# Altium project AM625SIP.PrjPcb
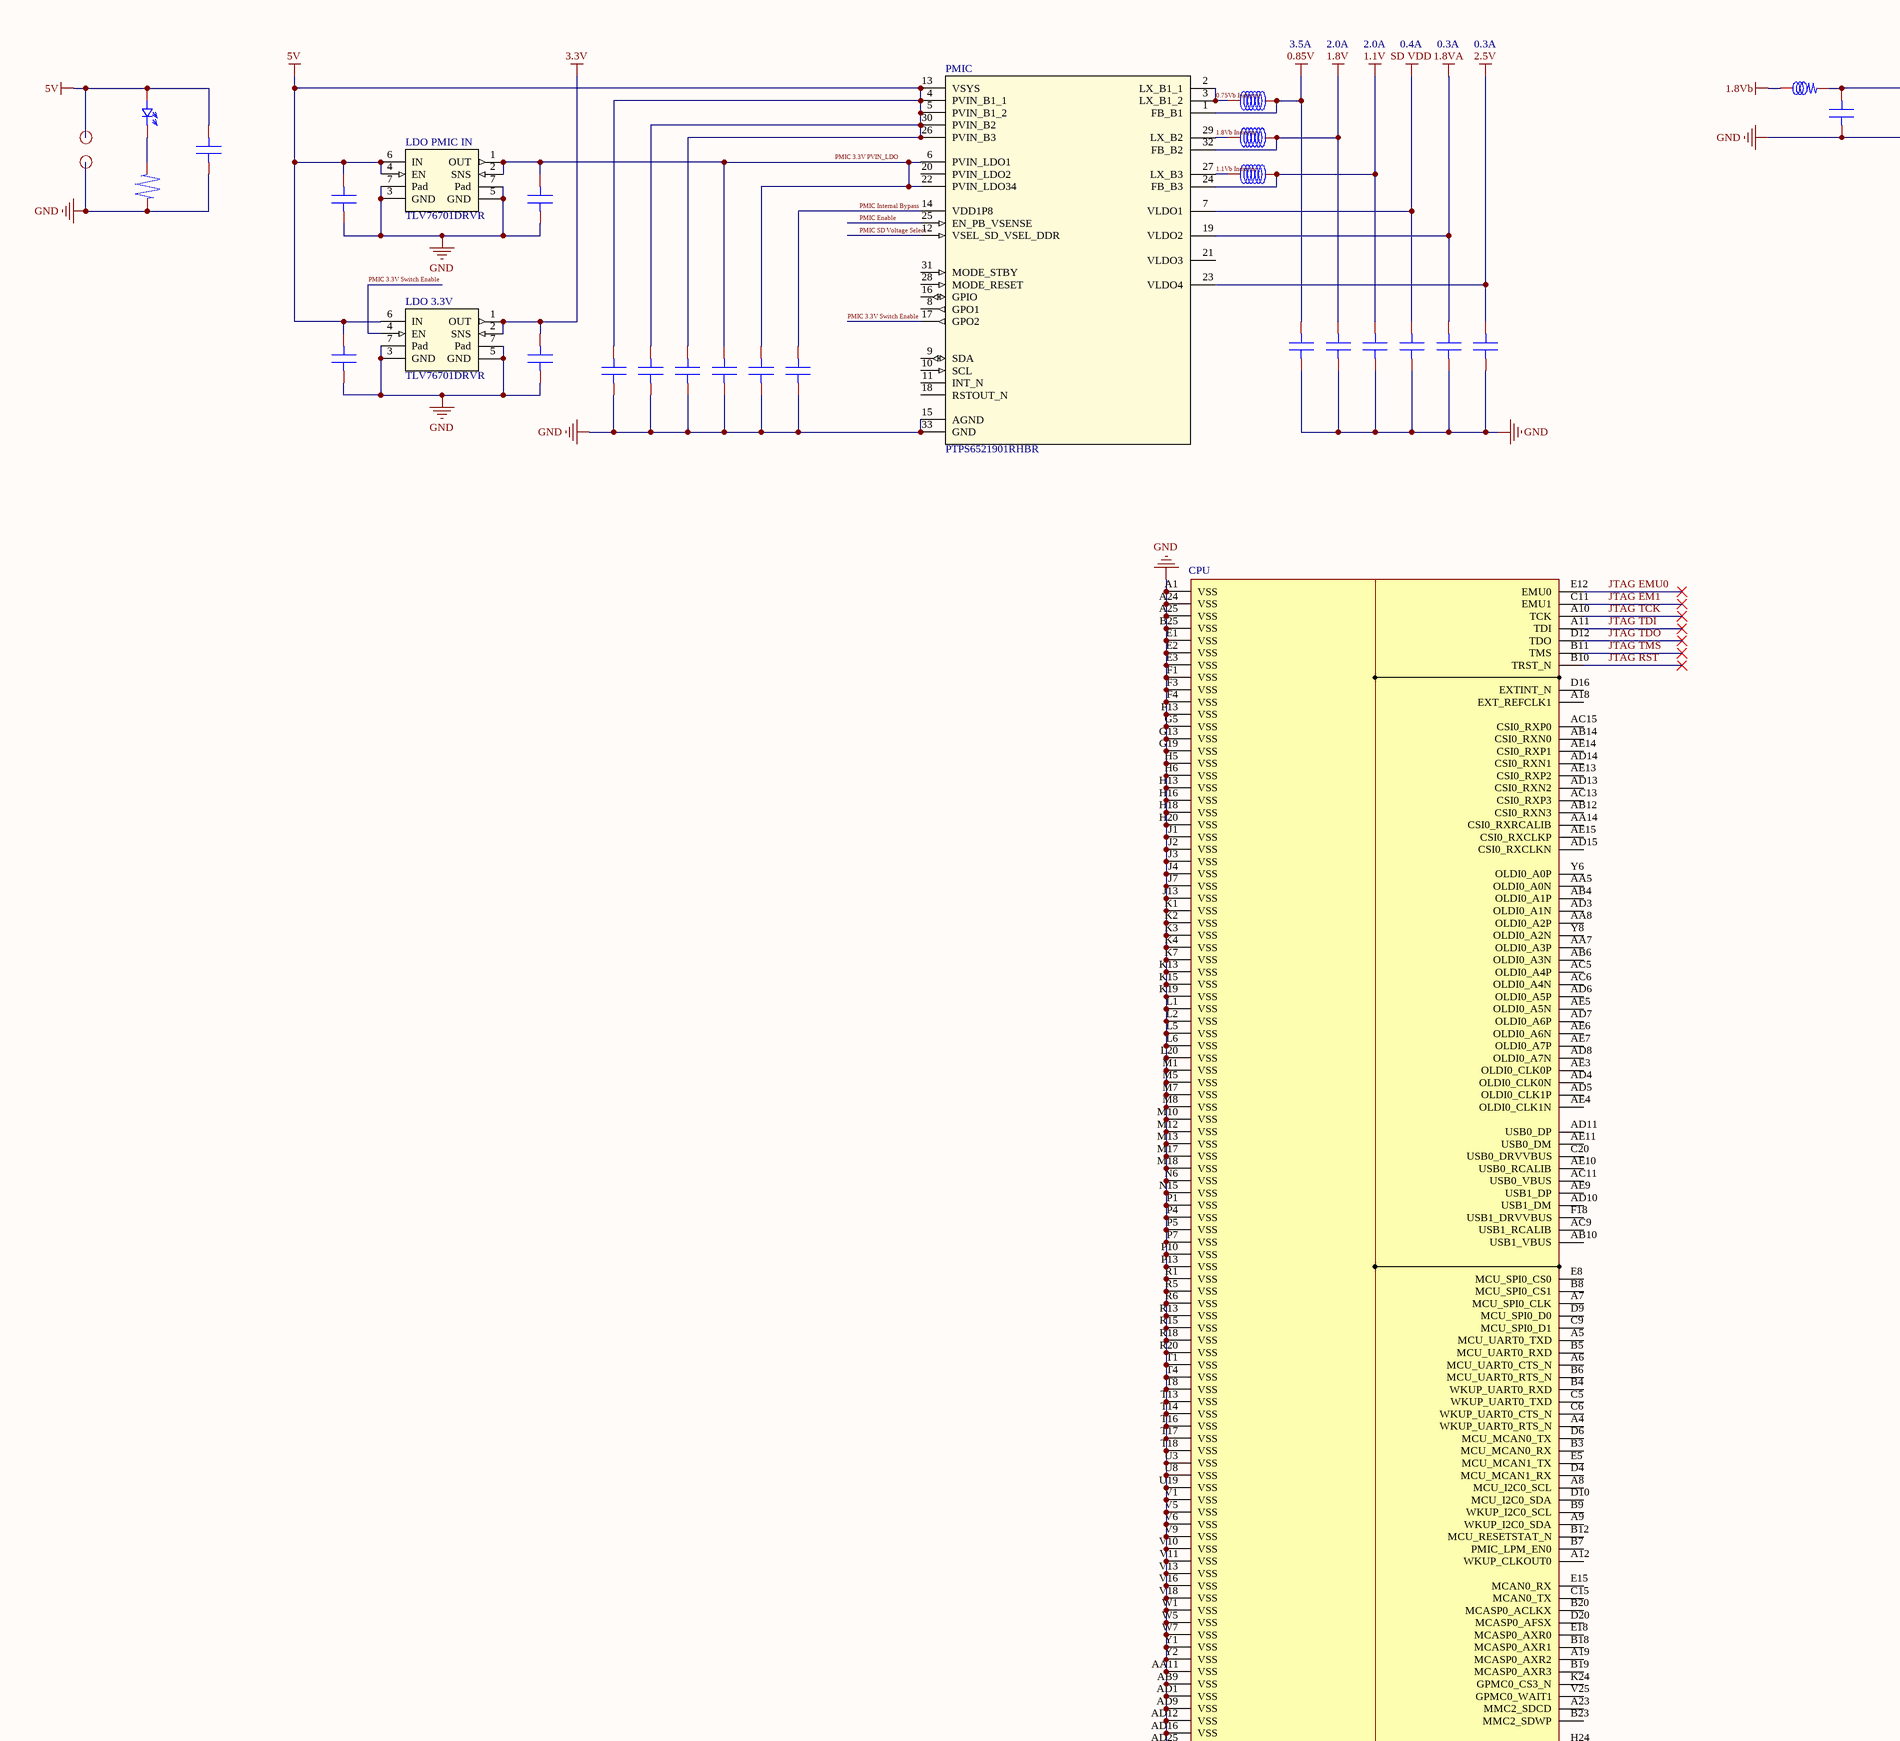
[diagram p0: AM625SIP.SchDoc, top left]
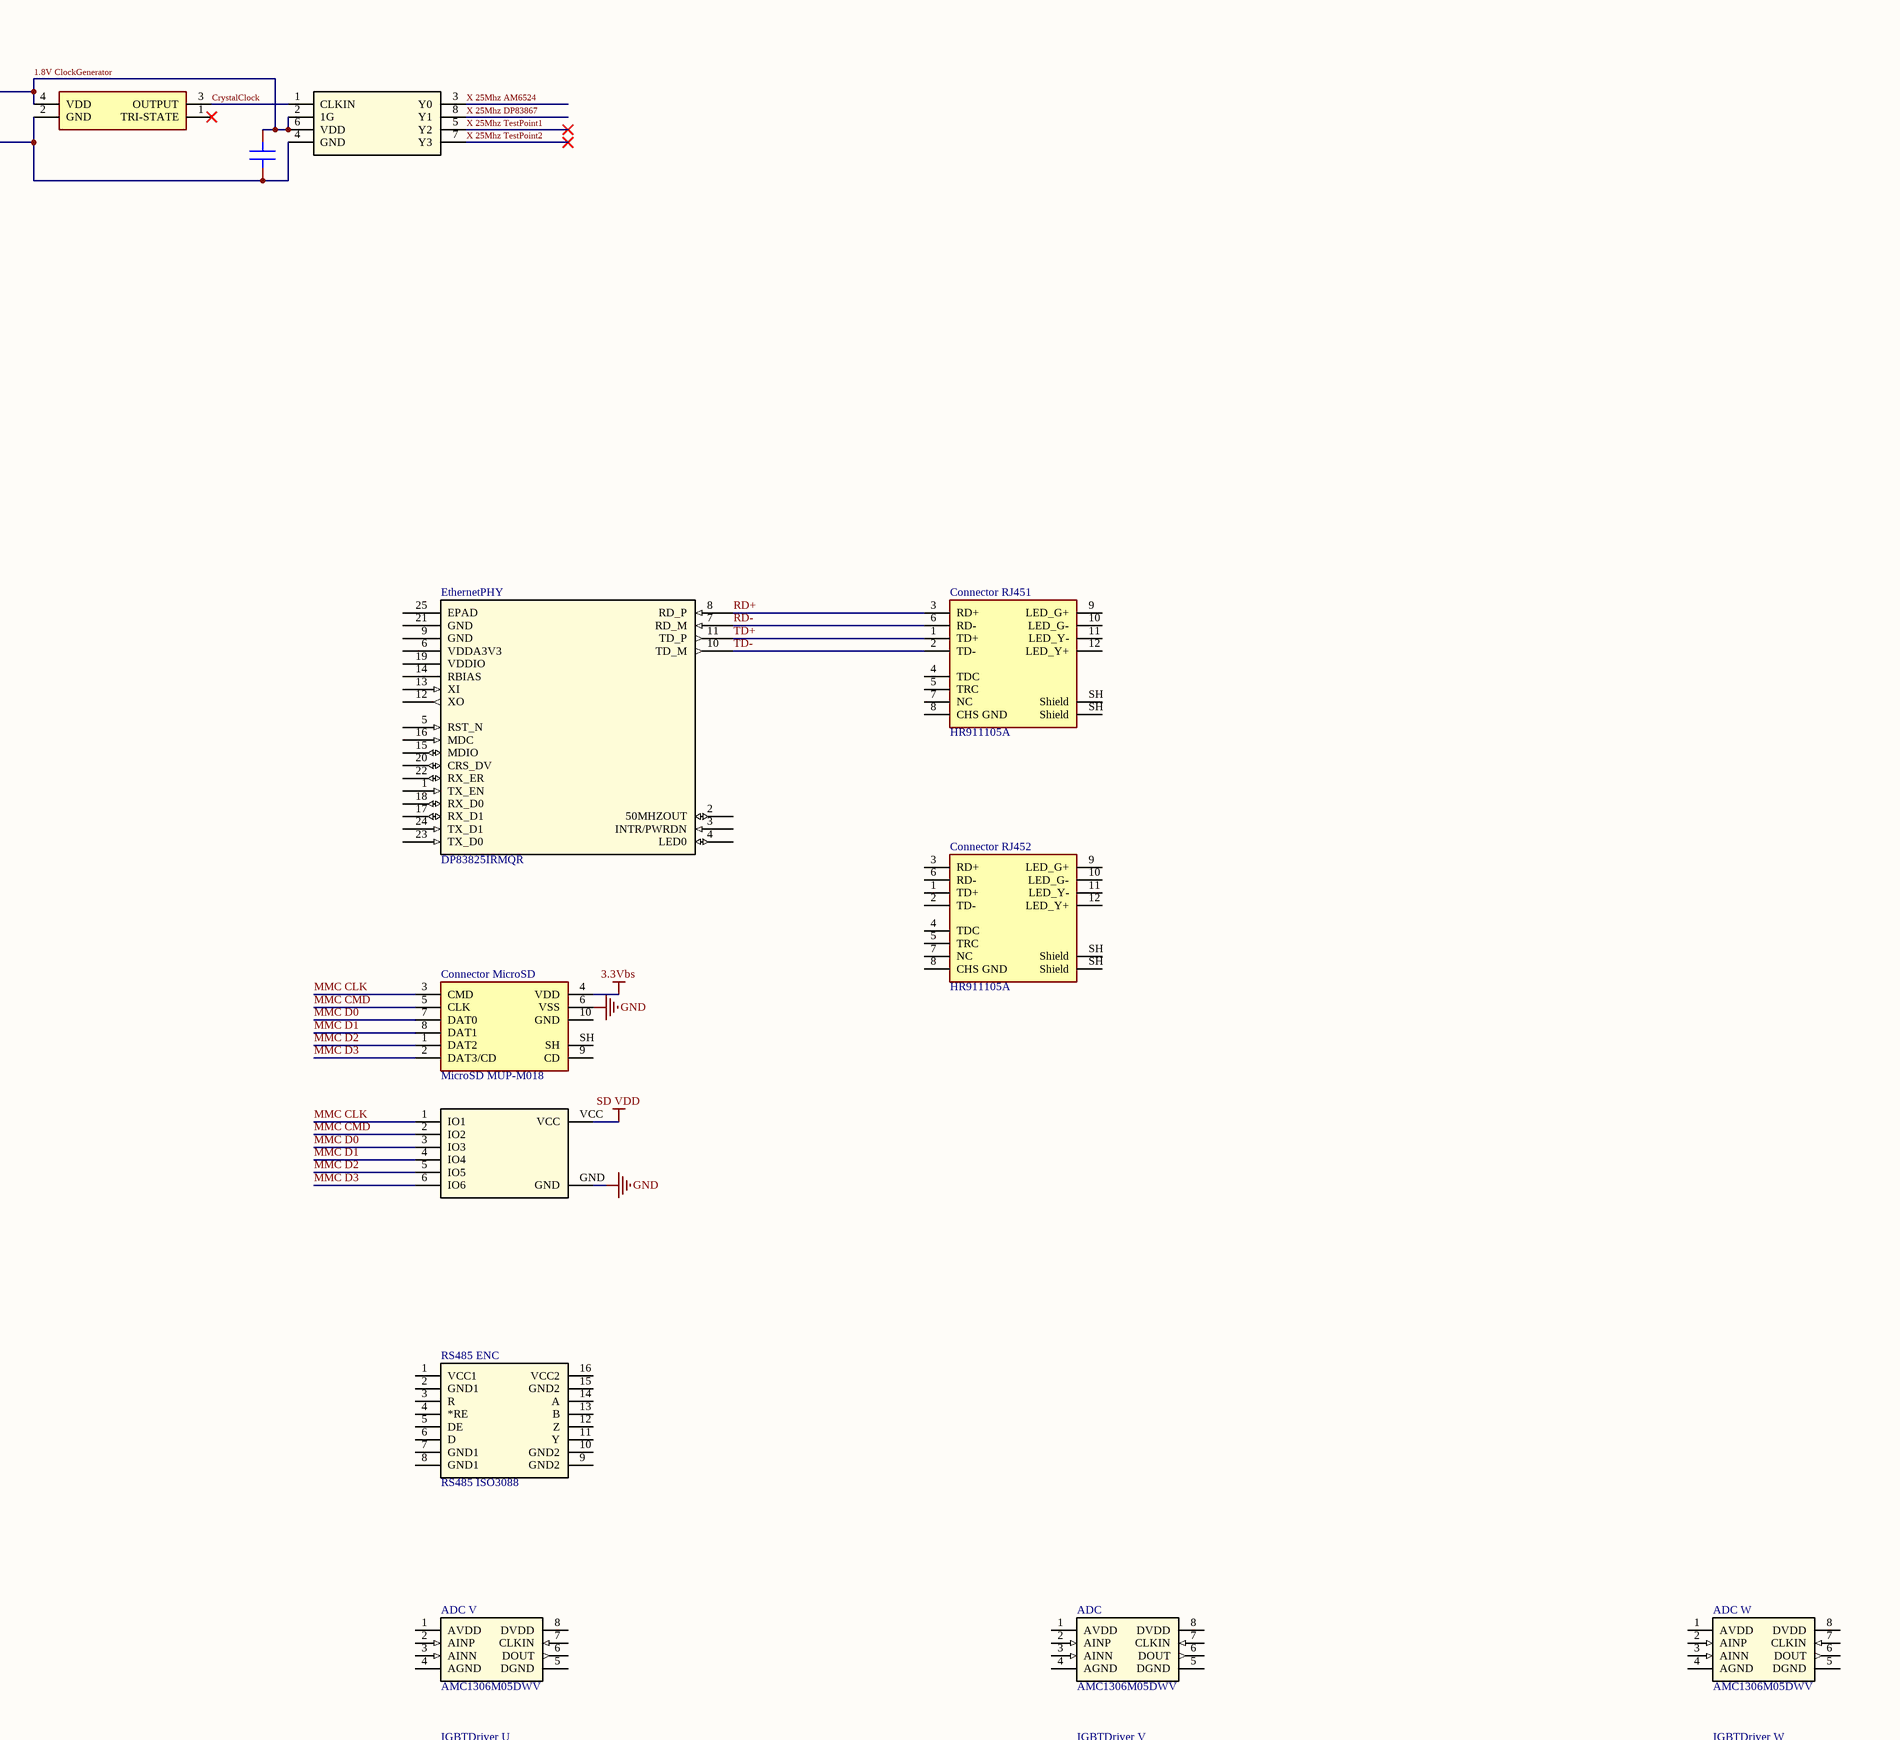
[diagram p1: AM625SIP.SchDoc, top right]
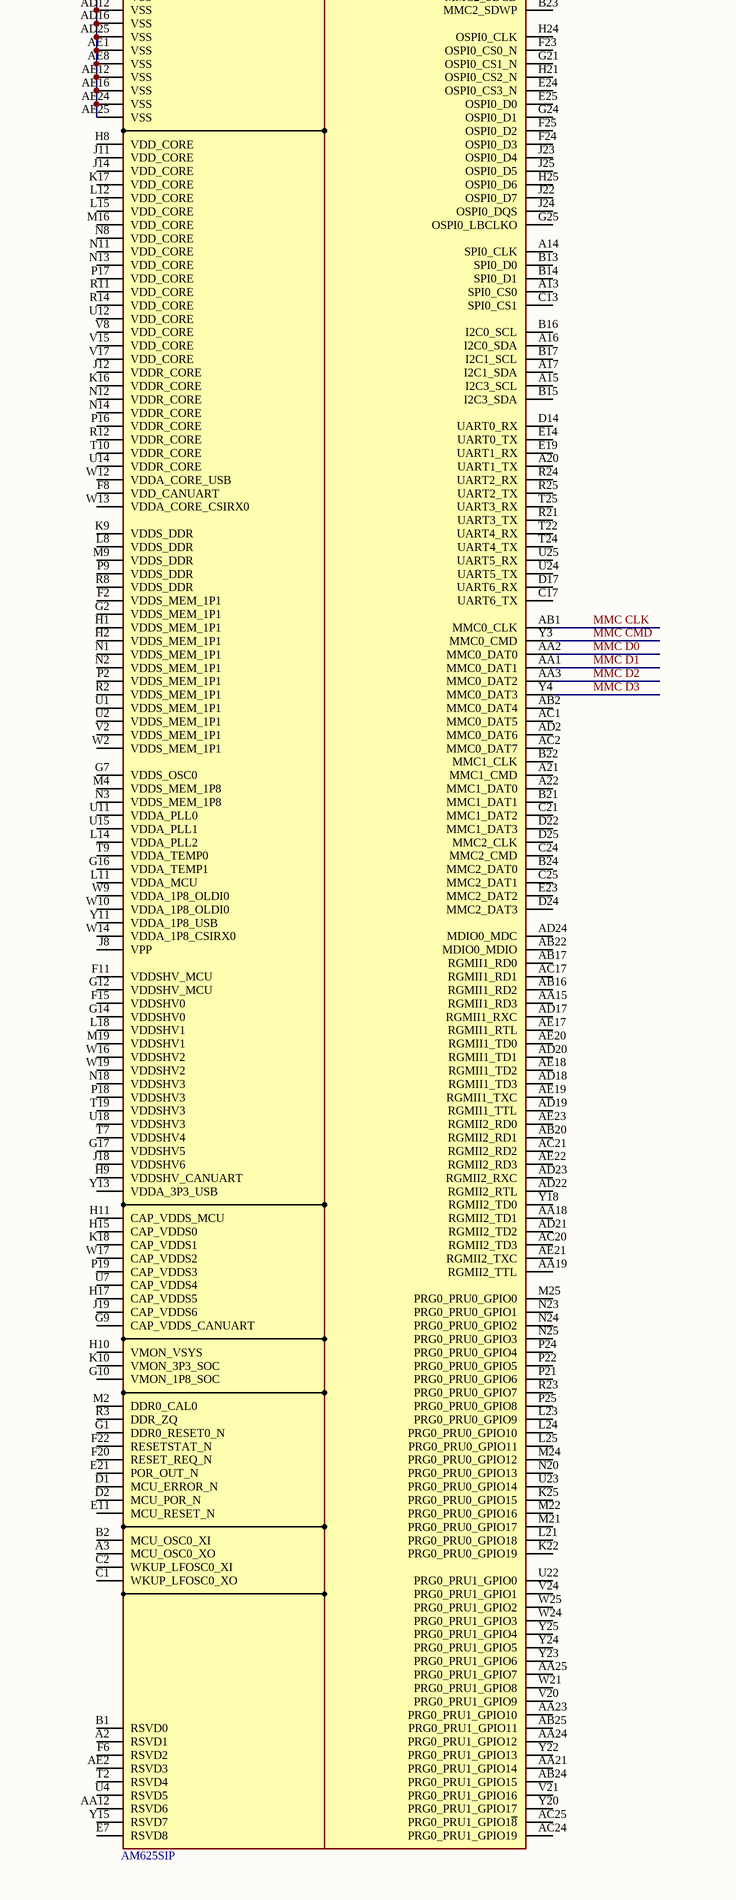
[diagram p2: AM625SIP.SchDoc, bottom left]
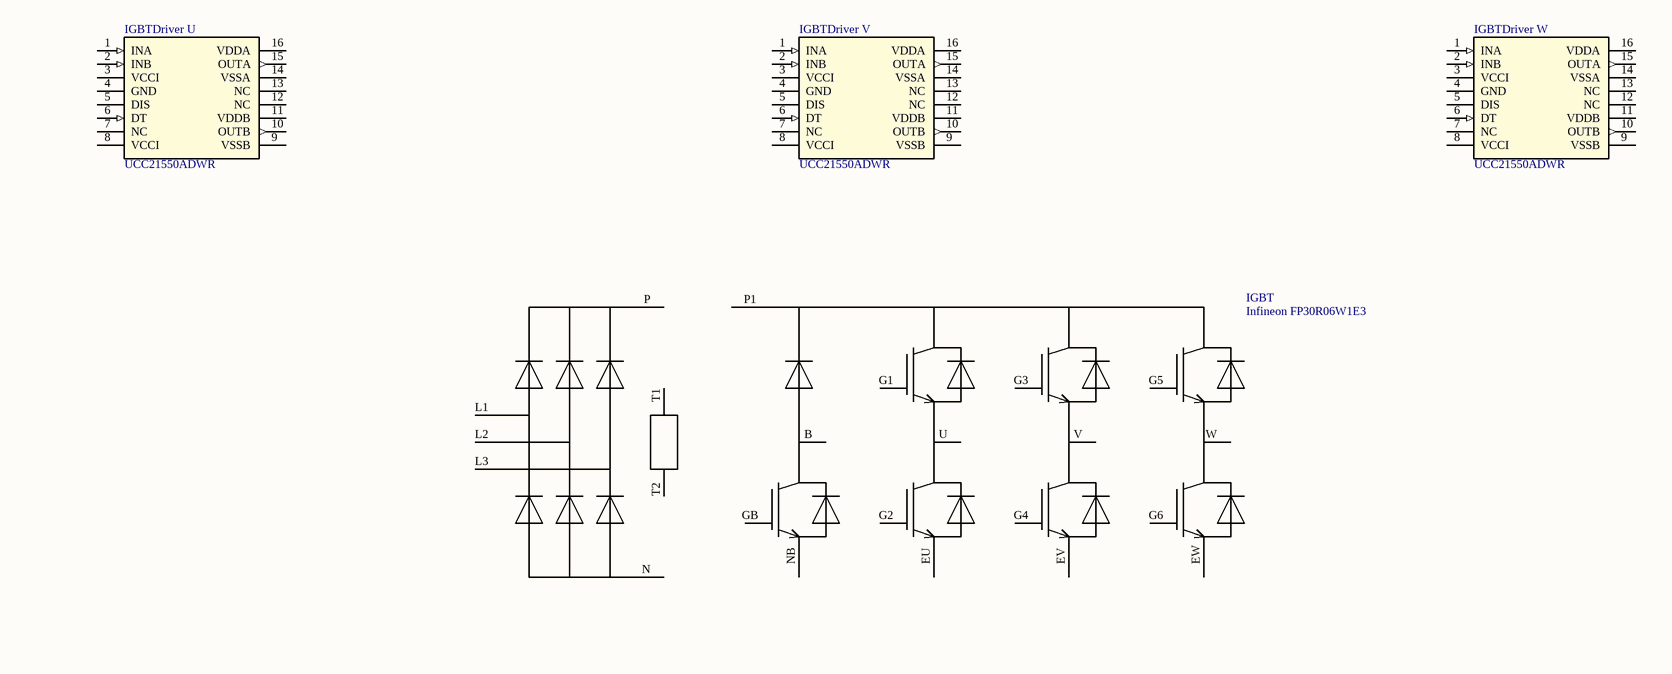
[diagram p3: AM625SIP.SchDoc, bottom right]
1 sheet, 46 parts. Net scope: global (net labels, ports and power ports of the same name join across sheets).
Board file: AM625SIP.PcbDoc

## Sheet AM625SIP.SchDoc
size A0; SheetNumber: 1; SheetTotal: 1

### Parts
ADC  AMC1306M05DWV  [AMC1306M05]
ADC_V  AMC1306M05DWV  [AMC1306M05]
ADC_W  AMC1306M05DWV  [AMC1306M05]
C_1.8V_ClockBuffer  1uF  [Capacitor 2012(0805)]  (value not drawn)
C_1.8V_Crystal  1uF  [Capacitor 2012(0805)]  (value not drawn)
C_12V  22uF  [Capacitor 2012(0805)]  (value not drawn)
C_LDO_3.3V_IN  22uF  [Capacitor 2012(0805)]  (value not drawn)
C_LDO_3.3V_OUT  22uF  [Capacitor 2012(0805)]  (value not drawn)
C_LDO_PMIC_IN  22uF  [Capacitor 2012(0805)]  (value not drawn)
C_LDO_PMIC_OUT  22uF  [Capacitor 2012(0805)]  (value not drawn)
C_PMIC_0.75V  47uF  [Capacitor 2012(0805)]  (value not drawn)
C_PMIC_1.1V  47uF  [Capacitor 2012(0805)]  (value not drawn)
C_PMIC_1.8V  47uF  [Capacitor 2012(0805)]  (value not drawn)
C_PMIC_1.8V*  2.2uF  [Capacitor 2012(0805)]  (value not drawn)
C_PMIC_2.5V  2.2uF  [Capacitor 2012(0805)]  (value not drawn)
C_PMIC_InternalBypass  2.2uF  [Capacitor 2012(0805)]  (value not drawn)
C_PMIC_SD_VDD  2.2uF  [Capacitor 2012(0805)]  (value not drawn)
C_PMIC_VIN_B1  4.7uF  [Capacitor 2012(0805)]  (value not drawn)
C_PMIC_VIN_B2  4.7uF  [Capacitor 2012(0805)]  (value not drawn)
C_PMIC_VIN_B3  4.7uF  [Capacitor 2012(0805)]  (value not drawn)
C_PMIC_VIN_LDO1  2.2uF  [Capacitor 2012(0805)]  (value not drawn)
C_PMIC_VIN_LDO34  4.7uF  [Capacitor 2012(0805)]  (value not drawn)
ClockBuffer  Clock Buffer  [ClockBuffer LMK1C1104]  (value not drawn)
Connector_5V  Connector BergStrip  [BergStrip]  (value not drawn)
Connector_GND?  Connector BergStrip  [BergStrip]  (value not drawn)
Connector_MicroSD  MicroSD MUP-M018  [MicroSD MUP-M018]
Connector_RJ451  HR911105A  [RJ45 HR911105A]
Connector_RJ452  HR911105A  [RJ45 HR911105A]
CPU  AM625SIP  [AM625SIP]
ESD  ESD 6Channel  [ESD 6Channel UQFN]  (value not drawn)
EthernetPHY  DP83825IRMQR  [DP83825IRMQR]
F_1.8V_Crystal  Ferrite  [Ferrite 2012(0805)]  (value not drawn)
IGBT  Infineon FP30R06W1E3  [FP30R06W1E3]
IGBTDriver_U  UCC21550ADWR  [UCC21550ADWR]
IGBTDriver_V  UCC21550ADWR  [UCC21550ADWR]
IGBTDriver_W  UCC21550ADWR  [UCC21550ADWR]
L_PMIC_Buck1  0.47uH  [Inductor 2016(0806)]  (value not drawn)
L_PMIC_Buck2  0.47uH  [Inductor 2016(0806)]  (value not drawn)
L_PMIC_Buck3  0.47uH  [Inductor 2016(0806)]  (value not drawn)
LDO_3.3V  TLV76701DRVR  [TLV76701DRVR]
LDO_PMIC_IN  TLV76701DRVR  [TLV76701DRVR]
LED_12V  Ferrite  [LED 2012(0805)]  (value not drawn)
PMIC  PTPS6521901RHBR  [PMIC TPS6521901RHBR]
R_12V_LED  Resistor  [Resistor 2012(0805)]  (value not drawn)
RS485_ENC  RS485 ISO3088  [ISO3088]
X  Crystal 4pin  [Crystal 2.5x2mm]  (value not drawn)

### Nets
0.85V: C_PMIC_0.75V.2 L_PMIC_Buck1.2 PMIC.1(FB_B1)
1.1V: C_PMIC_1.1V.2 L_PMIC_Buck3.2 PMIC.24(FB_B3)
1.8V: C_PMIC_1.8V.2 L_PMIC_Buck2.2 PMIC.32(FB_B2)
1.8VA: C_PMIC_1.8V*.2 PMIC.19(VLDO2)
1.8Vb: F_1.8V_Crystal.1
2.5V: C_PMIC_2.5V.2 PMIC.23(VLDO4)
3.3V: C_LDO_3.3V_OUT.2 LDO_3.3V.1(OUT) LDO_3.3V.2(SNS)
3.3Vbs: Connector_MicroSD.4(VDD)
5V: C_12V.2 C_LDO_3.3V_IN.2 C_LDO_PMIC_IN.2 C_PMIC_VIN_B1.2 C_PMIC_VIN_B2.2 C_PMIC_VIN_B3.2 Connector_5V.1(Pin) LDO_3.3V.6(IN) LDO_PMIC_IN.4(EN) LDO_PMIC_IN.6(IN) LED_12V.1 PMIC.4(PVIN_B1_1) PMIC.5(PVIN_B1_2) PMIC.13(VSYS) PMIC.26(PVIN_B3) PMIC.30(PVIN_B2)
GND: C_1.8V_ClockBuffer.1 C_1.8V_Crystal.1 C_12V.1 C_LDO_3.3V_IN.1 C_LDO_3.3V_OUT.1 C_LDO_PMIC_IN.1 C_LDO_PMIC_OUT.1 C_PMIC_0.75V.1 C_PMIC_1.1V.1 C_PMIC_1.8V.1 C_PMIC_1.8V*.1 C_PMIC_2.5V.1 C_PMIC_InternalBypass.1 C_PMIC_SD_VDD.1 C_PMIC_VIN_B1.1 C_PMIC_VIN_B2.1 C_PMIC_VIN_B3.1 C_PMIC_VIN_LDO1.1 C_PMIC_VIN_LDO34.1 ClockBuffer.4(GND) Connector_GND?.1(Pin) Connector_MicroSD.6(VSS) CPU.A1(VSS) CPU.A24(VSS) CPU.A25(VSS) CPU.AA11(VSS) CPU.AB9(VSS) CPU.AD1(VSS) CPU.AD9(VSS) CPU.AD12(VSS) CPU.AD16(VSS) CPU.AD25(VSS) CPU.AE1(VSS) CPU.AE8(VSS) CPU.AE12(VSS) CPU.AE16(VSS) CPU.AE24(VSS) CPU.AE25(VSS) CPU.B25(VSS) CPU.E1(VSS) CPU.E2(VSS) CPU.E3(VSS) CPU.F1(VSS) CPU.F3(VSS) CPU.F4(VSS) CPU.F13(VSS) CPU.G5(VSS) CPU.G13(VSS) CPU.G19(VSS) CPU.H5(VSS) CPU.H6(VSS) CPU.H13(VSS) CPU.H16(VSS) CPU.H18(VSS) CPU.H20(VSS) CPU.J1(VSS) CPU.J2(VSS) CPU.J3(VSS) CPU.J4(VSS) CPU.J7(VSS) CPU.J13(VSS) CPU.K1(VSS) CPU.K2(VSS) CPU.K3(VSS) CPU.K4(VSS) CPU.K7(VSS) CPU.K13(VSS) CPU.K15(VSS) CPU.K19(VSS) CPU.L1(VSS) CPU.L2(VSS) CPU.L5(VSS) CPU.L6(VSS) CPU.L20(VSS) CPU.M1(VSS) CPU.M5(VSS) CPU.M7(VSS) CPU.M8(VSS) CPU.M10(VSS) CPU.M12(VSS) CPU.M13(VSS) CPU.M17(VSS) CPU.M18(VSS) CPU.N6(VSS) CPU.N15(VSS) CPU.P1(VSS) CPU.P4(VSS) CPU.P5(VSS) CPU.P7(VSS) CPU.P10(VSS) CPU.P13(VSS) CPU.R1(VSS) CPU.R5(VSS) CPU.R6(VSS) CPU.R13(VSS) CPU.R15(VSS) CPU.R18(VSS) CPU.R20(VSS) CPU.T1(VSS) CPU.T4(VSS) CPU.T8(VSS) CPU.T13(VSS) CPU.T14(VSS) CPU.T16(VSS) CPU.T17(VSS) CPU.T18(VSS) CPU.U3(VSS) CPU.U8(VSS) CPU.U19(VSS) CPU.V1(VSS) CPU.V5(VSS) CPU.V6(VSS) CPU.V9(VSS) CPU.V10(VSS) CPU.V11(VSS) CPU.V13(VSS) CPU.V16(VSS) CPU.V18(VSS) CPU.W1(VSS) CPU.W5(VSS) CPU.W7(VSS) CPU.Y1(VSS) CPU.Y2(VSS) ESD.GND LDO_3.3V.3(GND) LDO_3.3V.5(GND) LDO_3.3V.7(Pad) LDO_PMIC_IN.3(GND) LDO_PMIC_IN.5(GND) LDO_PMIC_IN.7(Pad) PMIC.15(AGND) PMIC.33(GND) R_12V_LED.1 X.2(GND)
SD VDD: C_PMIC_SD_VDD.2 ESD.VCC PMIC.7(VLDO1)
0.75Vb Inductor: L_PMIC_Buck1.1 PMIC.2(LX_B1_1) PMIC.3(LX_B1_2)
1.1Vb Inductor: L_PMIC_Buck3.1 PMIC.27(LX_B3)
1.8V ClockGenerator: C_1.8V_ClockBuffer.2 C_1.8V_Crystal.2 ClockBuffer.2(1G) ClockBuffer.6(VDD) F_1.8V_Crystal.2 X.4(VDD)
1.8Vb Inductor: L_PMIC_Buck2.1 PMIC.29(LX_B2)
CrystalClock: ClockBuffer.1(CLKIN) X.3(OUTPUT)
JTAG EM1: CPU.C11(EMU1)
JTAG EMU0: CPU.E12(EMU0)
JTAG RST: CPU.B10(TRST_N)
JTAG TCK: CPU.A10(TCK)
JTAG TDI: CPU.A11(TDI)
JTAG TDO: CPU.D12(TDO)
JTAG TMS: CPU.B11(TMS)
MMC CLK: Connector_MicroSD.3(CMD) CPU.AB1(MMC0_CLK) ESD.1(IO1)
MMC CMD: Connector_MicroSD.5(CLK) CPU.Y3(MMC0_CMD) ESD.2(IO2)
MMC D0: Connector_MicroSD.7(DAT0) CPU.AA2(MMC0_DAT0) ESD.3(IO3)
MMC D1: Connector_MicroSD.8(DAT1) CPU.AA1(MMC0_DAT1) ESD.4(IO4)
MMC D2: Connector_MicroSD.1(DAT2) CPU.AA3(MMC0_DAT2) ESD.5(IO5)
MMC D3: Connector_MicroSD.2(DAT3/CD) CPU.Y4(MMC0_DAT3) ESD.6(IO6)
PMIC 3.3V PVIN_LDO: C_LDO_PMIC_OUT.2 C_PMIC_VIN_LDO1.2 C_PMIC_VIN_LDO34.2 LDO_PMIC_IN.1(OUT) LDO_PMIC_IN.2(SNS) PMIC.6(PVIN_LDO1) PMIC.22(PVIN_LDO34)
PMIC 3.3V Switch Enable: LDO_3.3V.4(EN) PMIC.17(GPO2)
PMIC Enable: PMIC.25(EN_PB_VSENSE)
PMIC Internal Bypass: C_PMIC_InternalBypass.2 PMIC.14(VDD1P8)
PMIC SD Voltage Select: PMIC.12(VSEL_SD_VSEL_DDR)
RD+: Connector_RJ451.3(RD+) EthernetPHY.8(RD_P)
RD-: Connector_RJ451.6(RD-) EthernetPHY.7(RD_M)
TD+: Connector_RJ451.1(TD+) EthernetPHY.11(TD_P)
TD-: Connector_RJ451.2(TD-) EthernetPHY.10(TD_M)
X 25Mhz AM6524: ClockBuffer.3(Y0)
X 25Mhz DP83867: ClockBuffer.8(Y1)
X 25Mhz TestPoint1: ClockBuffer.5(Y2)
X 25Mhz TestPoint2: ClockBuffer.7(Y3)
NetLED_12V_2: LED_12V.2 R_12V_LED.2

Not connected (* = marked no-connect by the designer): ADC 1(AVDD) 2(AINP) 3(AINN) 4(AGND) 5(DGND) 6(DOUT) 7(CLKIN) 8(DVDD); ADC_V 1(AVDD) 2(AINP) 3(AINN) 4(AGND) 5(DGND) 6(DOUT) 7(CLKIN) 8(DVDD); ADC_W 1(AVDD) 2(AINP) 3(AINN) 4(AGND) 5(DGND) 6(DOUT) 7(CLKIN) 8(DVDD); Connector_MicroSD 9(CD) 10(GND) SH; Connector_RJ451 4(TDC) 5(TRC) 7(NC) 8(CHS_GND) 9(LED_G+) 10(LED_G-) 11(LED_Y-) 12(LED_Y+) SH(Shield); Connector_RJ452 1(TD+) 2(TD-) 3(RD+) 4(TDC) 5(TRC) 6(RD-) 7(NC) 8(CHS_GND) 9(LED_G+) 10(LED_G-) 11(LED_Y-) 12(LED_Y+) SH(Shield); CPU A2(RSVD1) A3(MCU_OSC0_XO) A4(WKUP_UART0_RTS_N) A5(MCU_UART0_TXD) A6(MCU_UART0_CTS_N) A7(MCU_SPI0_CLK) A8(MCU_I2C0_SCL) A9(WKUP_I2C0_SDA) A12(WKUP_CLKOUT0) A13(SPI0_CS0) A14(SPI0_CLK) A15(I2C3_SCL) A16(I2C0_SDA) A17(I2C1_SDA) A18(EXT_REFCLK1) A19(MCASP0_AXR2) A20(UART1_TX) A21(MMC1_CMD) A22(MMC1_DAT0) A23(MMC2_SDCD) AA5(OLDI0_A0N) AA7(OLDI0_A3P) AA8(OLDI0_A2P) AA12(RSVD6) AA14(CSI0_RXRCALIB) AA15(RGMII1_RD3) AA18(RGMII2_TD1) AA19(RGMII2_TTL) AA21(PRG0_PRU1_GPIO14) AA23(PRG0_PRU1_GPIO10) AA24(PRG0_PRU1_GPIO12) AA25(PRG0_PRU1_GPIO7) AB2(MMC0_DAT4) AB4(OLDI0_A1P) AB6(OLDI0_A3N) AB10(USB1_VBUS) AB12(CSI0_RXN3) AB14(CSI0_RXN0) AB16(RGMII1_RD2) AB17(RGMII1_RD0) AB20(RGMII2_RD1) AB22(MDIO0_MDIO) AB24(PRG0_PRU1_GPIO15) AB25(PRG0_PRU1_GPIO11) AC1(MMC0_DAT5) AC2(MMC0_DAT7) AC5(OLDI0_A4P) AC6(OLDI0_A4N) AC9(USB1_RCALIB) AC11(USB0_VBUS) AC13(CSI0_RXP3) AC15(CSI0_RXP0) AC17(RGMII1_RD1) AC20(RGMII2_TD3) AC21(RGMII2_RD2) AC24(PRG0_PRU1_GPIO19) AC25(PRG0_PRU1_GPIO1~{8}) AD2(MMC0_DAT6) AD3(OLDI0_A1N) AD4(OLDI0_CLK0N) AD5(OLDI0_CLK1P) AD6(OLDI0_A5P) AD7(OLDI0_A6P) AD8(OLDI0_A7N) AD10(USB1_DM) AD11(USB0_DP) AD13(CSI0_RXN2) AD14(CSI0_RXN1) AD15(CSI0_RXCLKN) AD17(RGMII1_RXC) AD18(RGMII1_TD3) AD19(RGMII1_TTL) AD20(RGMII1_TD1) AD21(RGMII2_TD2) AD22(RGMII2_RTL) AD23(RGMII2_RXC) AD24(MDIO0_MDC) AE2(RSVD3) AE3(OLDI0_CLK0P) AE4(OLDI0_CLK1N) AE5(OLDI0_A5N) AE6(OLDI0_A6N) AE7(OLDI0_A7P) AE9(USB1_DP) AE10(USB0_RCALIB) AE11(USB0_DM) AE13(CSI0_RXP2) AE14(CSI0_RXP1) AE15(CSI0_RXCLKP) AE17(RGMII1_RTL) AE18(RGMII1_TD2) AE19(RGMII1_TXC) AE20(RGMII1_TD0) AE21(RGMII2_TXC) AE22(RGMII2_RD3) AE23(RGMII2_RD0) B1(RSVD0) B2(MCU_OSC0_XI) B3(MCU_MCAN0_RX) B4(WKUP_UART0_RXD) B5(MCU_UART0_RXD) B6(MCU_UART0_RTS_N) B7(PMIC_LPM_EN0) B8(MCU_SPI0_CS1) B9(WKUP_I2C0_SCL) B12(MCU_RESETSTAT_N) B13(SPI0_D0) B14(SPI0_D1) B15(I2C3_SDA) B16(I2C0_SCL) B17(I2C1_SCL) B18(MCASP0_AXR1) B19(MCASP0_AXR3) B20(MCASP0_ACLKX) B21(MMC1_DAT1) B22(MMC1_CLK) B23(MMC2_SDWP) B24(MMC2_DAT0) C1(WKUP_LFOSC0_XO) C2(WKUP_LFOSC0_XI) C5(WKUP_UART0_TXD) C6(WKUP_UART0_CTS_N) C9(MCU_SPI0_D1) C13(SPI0_CS1) C15(MCAN0_TX) C17(UART6_TX) C20(USB0_DRVVBUS) C21(MMC1_DAT2) C24(MMC2_CMD) C25(MMC2_DAT1) D1(MCU_ERROR_N) D2(MCU_POR_N) D4(MCU_MCAN1_RX) D6(MCU_MCAN0_TX) D9(MCU_SPI0_D0) D10(MCU_I2C0_SDA) D14(UART0_RX) D16(EXTINT_N) D17(UART6_RX) D20(MCASP0_AFSX) D22(MMC1_DAT3) D24(MMC2_DAT3) D25(MMC2_CLK) E5(MCU_MCAN1_TX) E7(RSVD8) E8(MCU_SPI0_CS0) E11(MCU_RESET_N) E14(UART0_TX) E15(MCAN0_RX) E18(MCASP0_AXR0) E19(UART1_RX) E21(POR_OUT_N) E23(MMC2_DAT2) E24(OSPI0_CS3_N) E25(OSPI0_D0) F2(VDDS_MEM_1P1) F6(RSVD2) F8(VDD_CANUART) F11(VDDSHV_MCU) F15(VDDSHV0) F18(USB1_DRVVBUS) F20(RESET_REQ_N) F22(RESETSTAT_N) F23(OSPI0_CS0_N) F24(OSPI0_D3) F25(OSPI0_D2) G1(DDR0_RESET0_N) G2(VDDS_MEM_1P1) G7(VDDS_OSC0) G9(CAP_VDDS_CANUART) G10(VMON_1P8_SOC) G12(VDDSHV_MCU) G14(VDDSHV0) G16(VDDA_TEMP1) G17(VDDSHV5) G21(OSPI0_CS1_N) G24(OSPI0_D1) G25(OSPI0_LBCLKO) H1(VDDS_MEM_1P1) H2(VDDS_MEM_1P1) H8(VDD_CORE) H9(VDDSHV_CANUART) H10(VMON_VSYS) H11(CAP_VDDS_MCU) H15(CAP_VDDS0) H17(CAP_VDDS5) H21(OSPI0_CS2_N) H24(OSPI0_CLK) H25(OSPI0_D6) J8(VPP) J11(VDD_CORE) J12(VDDR_CORE) J14(VDD_CORE) J18(VDDSHV6) J19(CAP_VDDS6) J22(OSPI0_D7) J23(OSPI0_D4) J24(OSPI0_DQS) J25(OSPI0_D5) K9(VDDS_DDR) K10(VMON_3P3_SOC) K16(VDDR_CORE) K17(VDD_CORE) K18(CAP_VDDS1) K22(PRG0_PRU0_GPIO19) K24(GPMC0_CS3_N) K25(PRG0_PRU0_GPIO15) L8(VDDS_DDR) L11(VDDA_MCU) L12(VDD_CORE) L14(VDDA_PLL2) L15(VDD_CORE) L18(VDDSHV1) L21(PRG0_PRU0_GPIO18) L23(PRG0_PRU0_GPIO9) L24(PRG0_PRU0_GPIO10) L25(PRG0_PRU0_GPIO11) M2(DDR0_CAL0) M4(VDDS_MEM_1P8) M9(VDDS_DDR) M16(VDD_CORE) M19(VDDSHV1) M21(PRG0_PRU0_GPIO17) M22(PRG0_PRU0_GPIO16) M24(PRG0_PRU0_GPIO12) M25(PRG0_PRU0_GPIO0) N1(VDDS_MEM_1P1) N2(VDDS_MEM_1P1) N3(VDDS_MEM_1P8) N8(VDD_CORE) N11(VDD_CORE) N12(VDDR_CORE) N13(VDD_CORE) N14(VDDR_CORE) N18(VDDSHV3) N20(PRG0_PRU0_GPIO13) N23(PRG0_PRU0_GPIO1) N24(PRG0_PRU0_GPIO2) N25(PRG0_PRU0_GPIO3) P2(VDDS_MEM_1P1) P9(VDDS_DDR) P16(VDDR_CORE) P17(VDD_CORE) P18(VDDSHV3) P19(CAP_VDDS3) P21(PRG0_PRU0_GPIO6) P22(PRG0_PRU0_GPIO5) P24(PRG0_PRU0_GPIO4) P25(PRG0_PRU0_GPIO8) R2(VDDS_MEM_1P1) R3(DDR_ZQ) R8(VDDS_DDR) R11(VDD_CORE) R12(VDDR_CORE) R14(VDD_CORE) R21(UART3_TX) R23(PRG0_PRU0_GPIO7) R24(UART2_RX) R25(UART2_TX) T2(RSVD4) T7(VDDSHV4) T9(VDDA_TEMP0) T10(VDDR_CORE) T19(VDDSHV3) T22(UART4_RX) T24(UART4_TX) T25(UART3_RX) U1(VDDS_MEM_1P1) U2(VDDS_MEM_1P1) U4(RSVD5) U7(CAP_VDDS4) U11(VDDA_PLL0) U12(VDD_CORE) U14(VDDR_CORE) U15(VDDA_PLL1) U18(VDDSHV3) U22(PRG0_PRU1_GPIO0) U23(PRG0_PRU0_GPIO14) U24(UART5_TX) U25(UART5_RX) V2(VDDS_MEM_1P1) V8(VDD_CORE) V15(VDD_CORE) V17(VDD_CORE) V20(PRG0_PRU1_GPIO9) V21(PRG0_PRU1_GPIO16) V24(PRG0_PRU1_GPIO1) V25(GPMC0_WAIT1) W2(VDDS_MEM_1P1) W9(VDDA_1P8_OLDI0) W10(VDDA_1P8_OLDI0) W12(VDDA_CORE_USB) W13(VDDA_CORE_CSIRX0) W14(VDDA_1P8_CSIRX0) W16(VDDSHV2) W17(CAP_VDDS2) W19(VDDSHV2) W21(PRG0_PRU1_GPIO8) W24(PRG0_PRU1_GPIO3) W25(PRG0_PRU1_GPIO2) Y6(OLDI0_A0P) Y8(OLDI0_A2N) Y11(VDDA_1P8_USB) Y13(VDDA_3P3_USB) Y15(RSVD7) Y18(RGMII2_TD0) Y20(PRG0_PRU1_GPIO17) Y22(PRG0_PRU1_GPIO13) Y23(PRG0_PRU1_GPIO6) Y24(PRG0_PRU1_GPIO5) Y25(PRG0_PRU1_GPIO4); EthernetPHY 1(TX_EN) 2(50MHZOUT) 3(INTR/PWRDN) 4(LED0) 5(RST_N) 6(VDDA3V3) 9(GND) 12(XO) 13(XI) 14(RBIAS) 15(MDIO) 16(MDC) 17(RX_D1) 18(RX_D0) 19(VDDIO) 20(CRS_DV) 21(GND) 22(RX_ER) 23(TX_D0) 24(TX_D1) 25(EPAD); IGBT B EU EV EW G1 G2 G3 G4 G5 G6 GB L1 L2 L3 N NB P P1 T1 T2 U V W; IGBTDriver_U 1(INA) 2(INB) 3(VCCI) 4(GND) 5(DIS) 6(DT) 7(NC) 8(VCCI) 9(VSSB) 10(OUTB) 11(VDDB) 12(NC) 13(NC) 14(VSSA) 15(OUTA) 16(VDDA); IGBTDriver_V 1(INA) 2(INB) 3(VCCI) 4(GND) 5(DIS) 6(DT) 7(NC) 8(VCCI) 9(VSSB) 10(OUTB) 11(VDDB) 12(NC) 13(NC) 14(VSSA) 15(OUTA) 16(VDDA); IGBTDriver_W 1(INA) 2(INB) 3(VCCI) 4(GND) 5(DIS) 6(DT) 7(NC) 8(VCCI) 9(VSSB) 10(OUTB) 11(VDDB) 12(NC) 13(NC) 14(VSSA) 15(OUTA) 16(VDDA); PMIC 8(GPO1) 9(SDA) 10(SCL) 11(INT_N) 16(GPIO) 18(RSTOUT_N) 20(PVIN_LDO2) 21(VLDO3) 28(MODE_RESET) 31(MODE_STBY); RS485_ENC 1(VCC1) 2(GND1) 3(R) 4(*RE) 5(DE) 6(D) 7(GND1) 8(GND1) 9(GND2) 10(GND2) 11(Y) 12(Z) 13(B) 14(A) 15(GND2) 16(VCC2); X 1(TRI-STATE)*

### Notes on the sheet
- 3.5A
- 2.0A
- 0.4A
- 0.3A

### Library data of the parts
ADC ADC_V ADC_W = AMC1306M05: ADC Isolated Delta-Sigm; Manufacturer_Name: Texas Instruments; TYPE: TYPE; RefDes: RefDes; Copyright: Copyright (C) 2025 Ultra Librarian. All rights reserved.; Manufacturer_Part_Number: AMC1306M05DWV; Datasheet: https://www.ti.com/lit/gpn/amc1306m05
C_1.8V_ClockBuffer C_1.8V_Crystal C_12V C_LDO_3.3V_IN C_LDO_3.3V_OUT C_LDO_PMIC_IN C_LDO_PMIC_OUT C_PMIC_0.75V C_PMIC_1.1V C_PMIC_1.8V C_PMIC_1.8V* C_PMIC_2.5V C_PMIC_InternalBypass C_PMIC_SD_VDD C_PMIC_VIN_B1-C_PMIC_VIN_B3 C_PMIC_VIN_LDO1 C_PMIC_VIN_LDO34 = Capacitor
ClockBuffer = Clock Buffer: Mfr_Name: Texas Instruments; TYPE: TYPE; RefDes: RefDes
Connector_5V Connector_GND? = Connector BergStrip: BergStrip
Connector_RJ451 Connector_RJ452 = RJ45 HR911105A
CPU = AM625SIP: CPU Quad Core A53 512MB RAM
ESD = ESD 6Channel: TPD6E001RSFR; Mfr_Name: Texas Instruments; RefDes: RefDes; Type: Type
EthernetPHY = DP83825IRMQR: Manufacturer_Name: Texas Instruments; Copyright: Copyright (C) 2025 Ultra Librarian. All rights reserved.; Manufacturer_Part_Number: DP83825IRMQR; Datasheet: https://www.ti.com/lit/gpn/dp83825i; RefDes: RefDes; Type: Type
IGBT = IGBT FP30R06W1E3
IGBTDriver_U IGBTDriver_V IGBTDriver_W = UCC21550ADWR: Isolated Half Bridge Driver; Manufacturer_Name: Texas Instruments; Type: Power Management; Copyright: Copyright (C) 2025 Ultra Librarian. All rights reserved.; Manufacturer_Part_Number: UCC21550ADWR; Datasheet: https://www.ti.com/lit/gpn/ucc21550; RefDes: RefDes
L_PMIC_Buck1-L_PMIC_Buck3 = Inductor
LDO_3.3V LDO_PMIC_IN = LDO TLV76701DRVR: LDO 1A; Manufacturer_Name: Texas Instruments; TYPE: TYPE; RefDes: RefDes; Copyright: Copyright (C) 2025 Ultra Librarian. All rights reserved.; Manufacturer_Part_Number: TLV76701DRVR; Datasheet: https://www.ti.com/lit/gpn/tlv767
LED_12V = LED
PMIC = PMIC TPS6521901RHBR: AM625 SIP PMIC; Manufacturer_Name: Texas Instruments; TYPE: TYPE; RefDes: RefDes; Copyright: Copyright (C) 2025 Ultra Librarian. All rights reserved.; Manufacturer_Part_Number: PTPS6521901RHBR
RS485_ENC = RS485 ISO3088: RS485 Isolated TransReciever; Manufacturer_Name: Texas Instruments; Manufacturer_Part_Number: ISO3088DW; Copyright: Copyright (C) 2025 Ultra Librarian. All rights reserved.; Datasheet: https://www.ti.com/lit/gpn/iso3088; RefDes: RefDes; Type: Type
X = Crystal 4pin: Manufacturer_Name: ECS; Manufacturer_Part_Number: ECS-2520MV-250-CN-TR; Geometry.Height: 0.9mm; Mouser Part Number: 520-2520MV-250-CN-T; Mouser Price/Stock: https://www.mouser.co.uk/ProductDetail/ECS/ECS-2520MV-250-CN-TR?qs=fAHHVMwC%252BbiTva9uv8VI%2Fw%3D%3D; Datasheet Link: https://www.arrow.com/en/products/ecs-2520mv-250-cn-tr/ecs-international